# Altium project PicoRom-Flex.PrjPcb
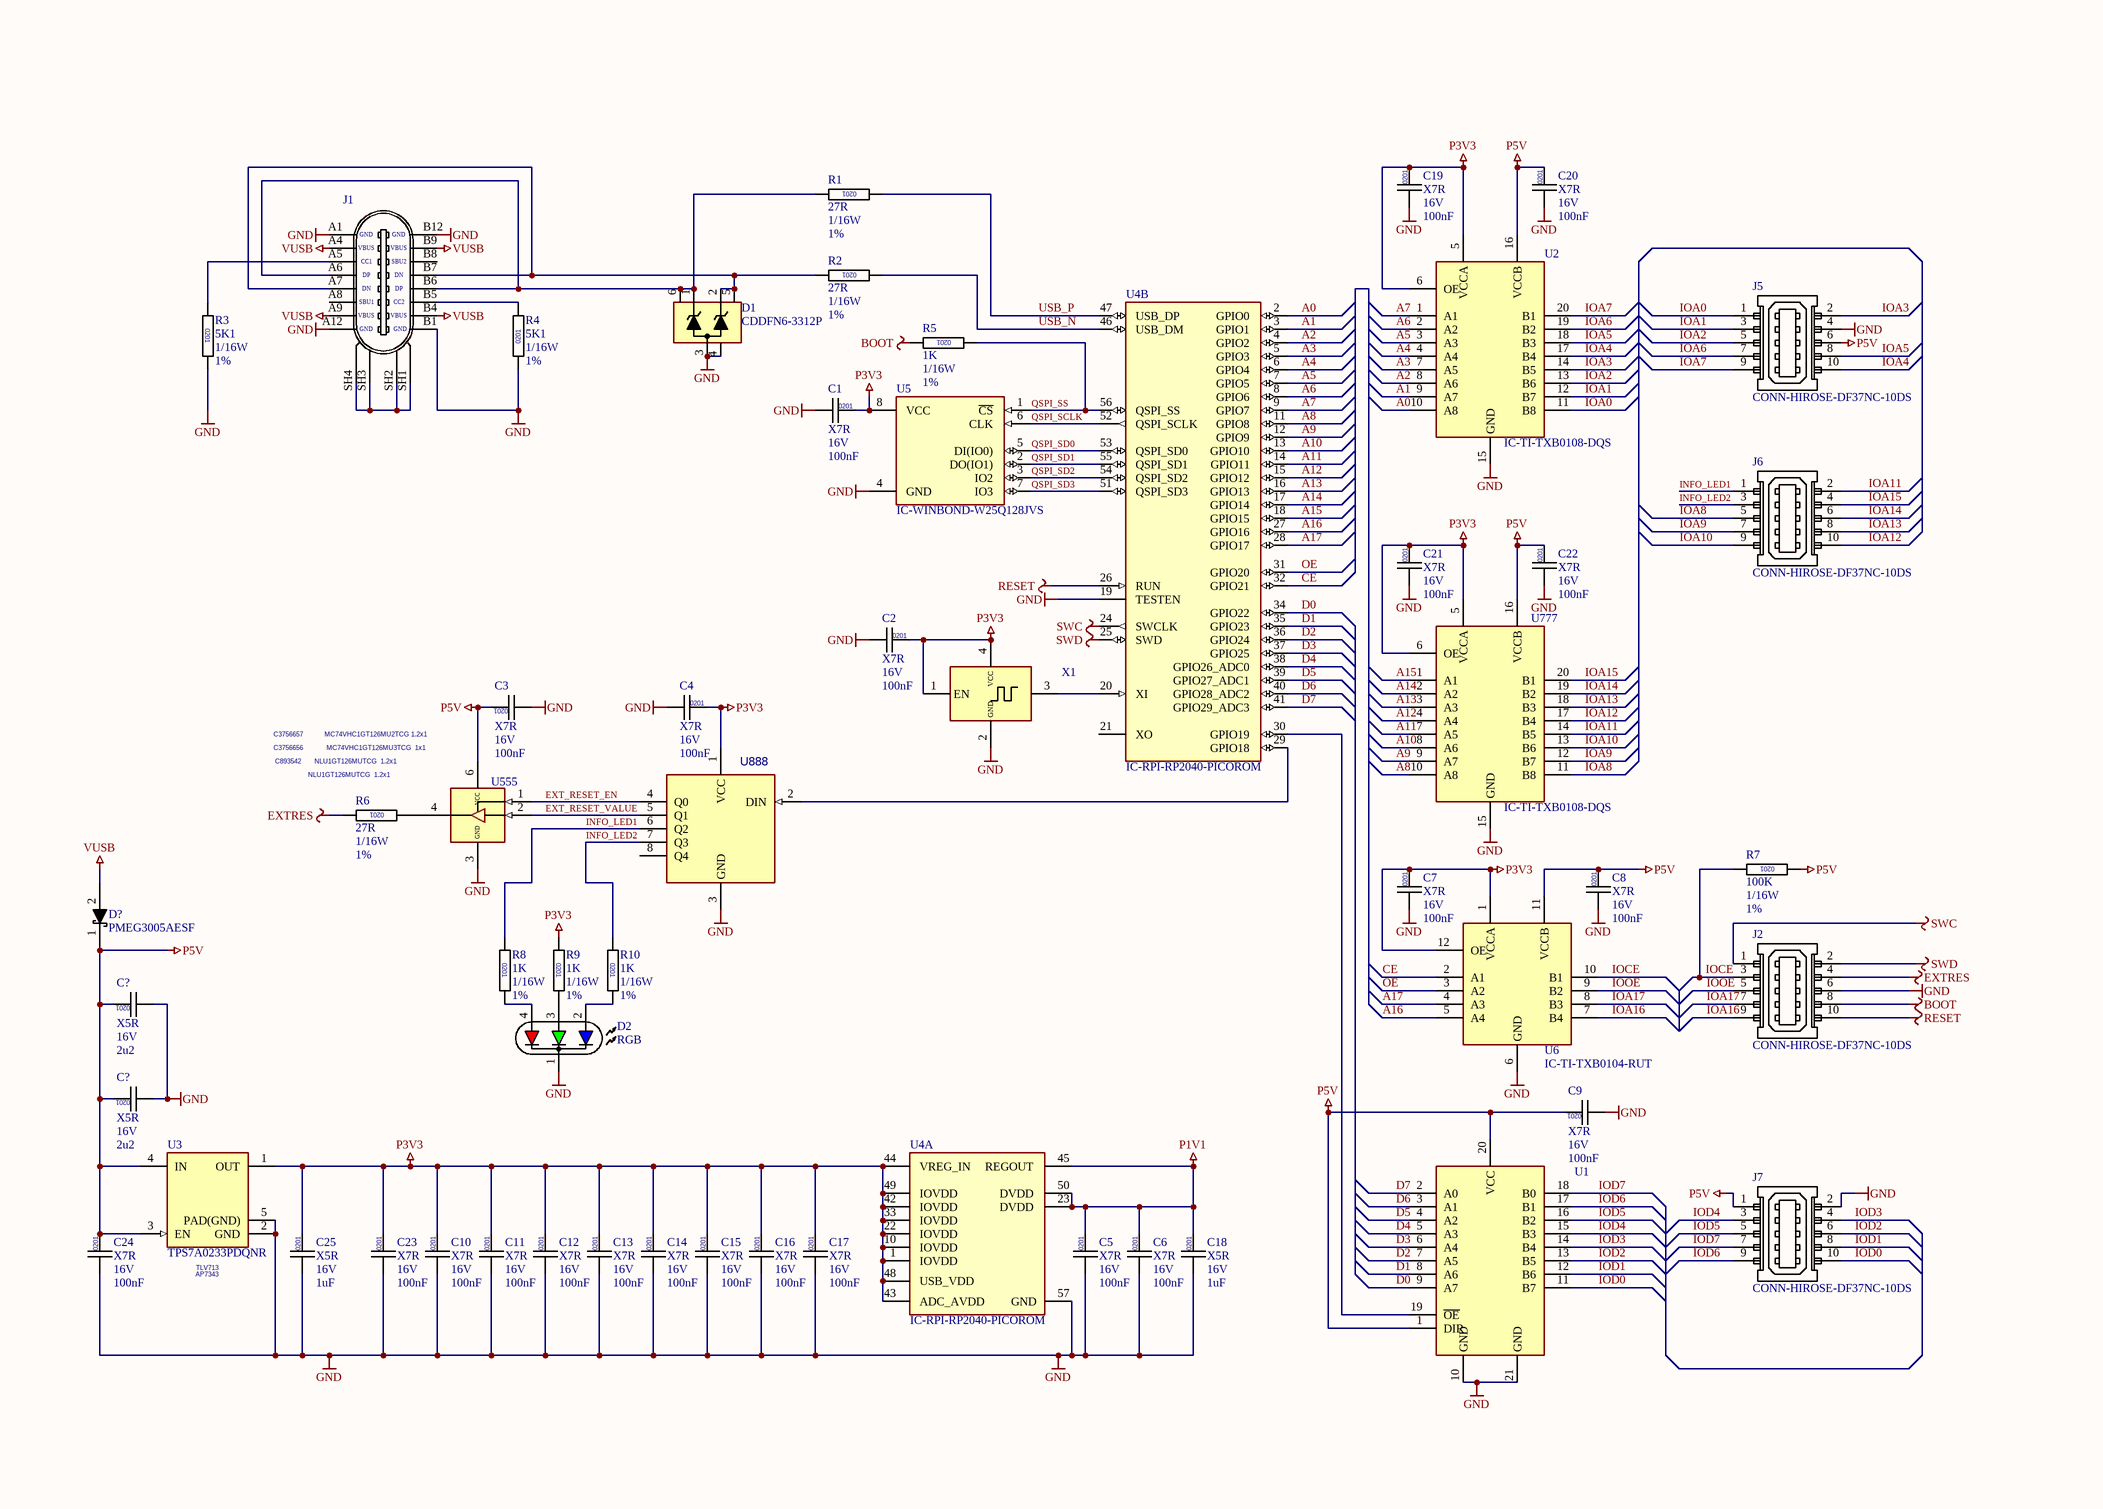
[diagram p0: PicoROM.SchDoc]
2 sheets, 59 parts. Net scope: hierarchical (ports join the sheet entries above them; power ports are global).
Board files: PICOROM-Flex.PcbDoc, pond.PcbDoc
Sheets:
  PicoROM.SchDoc
  2716-2736.SchDoc

## Sheet PicoROM.SchDoc
size A3; SheetNumber: 1; SheetTotal: 2

### Parts
(Parts that share a designator on the sheet are numbered #1, #2 ... from top to bottom, then left to right.)
C1  Dielectric: X7R  Voltage: 16V  Capacitance: 100nF  [CAPC0201]  (hidden comment: CAP0201)
C2  Dielectric: X7R  Voltage: 16V  Capacitance: 100nF  [CAPC0201]  (hidden comment: CAP0201)
C3  Dielectric: X7R  Voltage: 16V  Capacitance: 100nF  [CAPC0201]  (hidden comment: CAP0201)
C4  Dielectric: X7R  Voltage: 16V  Capacitance: 100nF  [CAPC0201]  (hidden comment: CAP0201)
C5  Dielectric: X7R  Voltage: 16V  Capacitance: 100nF  [CAPC0201]  (hidden comment: CAP0201)
C6  Dielectric: X7R  Voltage: 16V  Capacitance: 100nF  [CAPC0201]  (hidden comment: CAP0201)
C7  Dielectric: X7R  Voltage: 16V  Capacitance: 100nF  [CAPC0201]  (hidden comment: CAP0201)
C8  Dielectric: X7R  Voltage: 16V  Capacitance: 100nF  [CAPC0201]  (hidden comment: CAP0201)
C9  Dielectric: X7R  Voltage: 16V  Capacitance: 100nF  [CAPC0201]  (hidden comment: CAP0201)
C10  Dielectric: X7R  Voltage: 16V  Capacitance: 100nF  [CAPC0201]  (hidden comment: CAP0201)
C11  Dielectric: X7R  Voltage: 16V  Capacitance: 100nF  [CAPC0201]  (hidden comment: CAP0201)
C12  Dielectric: X7R  Voltage: 16V  Capacitance: 100nF  [CAPC0201]  (hidden comment: CAP0201)
C13  Dielectric: X7R  Voltage: 16V  Capacitance: 100nF  [CAPC0201]  (hidden comment: CAP0201)
C14  Dielectric: X7R  Voltage: 16V  Capacitance: 100nF  [CAPC0201]  (hidden comment: CAP0201)
C15  Dielectric: X7R  Voltage: 16V  Capacitance: 100nF  [CAPC0201]  (hidden comment: CAP0201)
C16  Dielectric: X7R  Voltage: 16V  Capacitance: 100nF  [CAPC0201]  (hidden comment: CAP0201)
C17  Dielectric: X7R  Voltage: 16V  Capacitance: 100nF  [CAPC0201]  (hidden comment: CAP0201)
C18  Dielectric: X5R  Voltage: 16V  Capacitance: 1uF  [CAPC0201]  (hidden comment: CAP0201)
C19  Dielectric: X7R  Voltage: 16V  Capacitance: 100nF  [CAPC0201]  (hidden comment: CAP0201)
C20  Dielectric: X7R  Voltage: 16V  Capacitance: 100nF  [CAPC0201]  (hidden comment: CAP0201)
C21  Dielectric: X7R  Voltage: 16V  Capacitance: 100nF  [CAPC0201]  (hidden comment: CAP0201)
C22  Dielectric: X7R  Voltage: 16V  Capacitance: 100nF  [CAPC0201]  (hidden comment: CAP0201)
C23  Dielectric: X7R  Voltage: 16V  Capacitance: 100nF  [CAPC0201]  (hidden comment: CAP0201)
C24  Dielectric: X7R  Voltage: 16V  Capacitance: 100nF  [CAPC0201]  (hidden comment: CAP0201)
C25  Dielectric: X5R  Voltage: 16V  Capacitance: 1uF  [CAPC0201]  (hidden comment: CAP0201)
C?#1  Dielectric: X5R  Voltage: 16V  Capacitance: 2u2  [CAPC0201]  (hidden comment: CAP0201)
C?#2  Dielectric: X5R  Voltage: 16V  Capacitance: 2u2  [CAPC0201]  (hidden comment: CAP0201)
D1  CDDFN6-3312P  [SON40P100X50-6L]
D2  RGB  [LED-1616-RGB]
D?  PMEG3005AESF
J1  CONN-SAMESKY-UJ20-C-V-G-SMT-P16-TR  [CONN-SAMESKY-UJ20-C-V-G-SMT-P16-TR]  (value not drawn)
J2  CONN-HIROSE-DF37NC-10DS  [CONN-HIROSE-DF37NC-10DS]
J5  CONN-HIROSE-DF37NC-10DS  [CONN-HIROSE-DF37NC-10DS]
J6  CONN-HIROSE-DF37NC-10DS  [CONN-HIROSE-DF37NC-10DS]
J7  CONN-HIROSE-DF37NC-10DS  [CONN-HIROSE-DF37NC-10DS]
R1  value 27R  Power: 1/16W  Tolerance: 1%  [RESC0201]  (hidden comment: RESC0201)
R2  value 27R  Power: 1/16W  Tolerance: 1%  [RESC0201]  (hidden comment: RESC0201)
R3  value 5K1  Power: 1/16W  Tolerance: 1%  [RESC0201]  (hidden comment: RESC0201)
R4  value 5K1  Power: 1/16W  Tolerance: 1%  [RESC0201]  (hidden comment: RESC0201)
R5  value 1K  Power: 1/16W  Tolerance: 1%  [RESC0201]  (hidden comment: RESC0201)
R6  value 27R  Power: 1/16W  Tolerance: 1%  [RESC0201]  (hidden comment: RESC0201)
R7  value 100K  Power: 1/16W  Tolerance: 1%  [RESC0201]  (hidden comment: RESC0201)
R8  value 1K  Power: 1/16W  Tolerance: 1%  [RESC0201]  (hidden comment: RESC0201)
R9  value 1K  Power: 1/16W  Tolerance: 1%  [RESC0201]  (hidden comment: RESC0201)
R10  value 1K  Power: 1/16W  Tolerance: 1%  [RESC0201]  (hidden comment: RESC0201)
U1  74AHCT245  [QFN50P450X250-20TH300X100]  (value not drawn)
U2  IC-TI-TXB0108-DQS  [SON40P200X55-20N]
U3  TPS7A0233PDQNR  [X2SON4-1X1]
U4  IC-RPI-RP2040-PICOROM  [QFN40P700X700X90-56N-TH310X310]  (parts A,B of 2)
U5  IC-WINBOND-W25Q128JVS  [SON50P300X60_HS-9N]
U6  IC-TI-TXB0104-RUT  [FOOTPRINT-TI-RUT]
U555  74LVC1G126  [SON40P100X50-6L]  (value not drawn)
U777  IC-TI-TXB0108-DQS  [SON40P200X55-20N]
U888  TCA5405RUGR  [X2QFN-8_L1.5-W1.5-P0.50-BL]  (value not drawn)
X1  XOSC  [XOSC-YXC-2016]  (value not drawn)

### Nets
BOOT: J2.8 R5.1
EXTRES: J2.4 R6.1
GND: C1.2 C2.2 C3.2 C4.2 C5.2 C6.2 C7.2 C8.2 C9.2 C10.2 C11.2 C12.2 C13.2 C14.2 C15.2 C16.2 C17.2 C18.2 C19.2 C20.2 C21.2 C22.2 C23.2 C24.2 C25.2 C?#1.2 C?#2.2 D1.3(A) D1.4(A) D2.1 J1.A1 J1.A12 J1.B1 J1.B12 J2.6 J5.4 J7.2 R3.1 R4.2 U1.10(GND) U1.21(GND) U2.15(GND) U3.2(GND) U3.5(PAD(GND)) U4.19(TESTEN) U4.57(GND) U5.4(GND) U6.6(GND) U555.3(GND) U777.15(GND) U888.3(GND) X1.2(GND)
P1V1: C5.1 C6.1 C18.1 U4.23(DVDD) U4.45(REGOUT) U4.50(DVDD)
P3V3: C1.1 C2.1 C4.1 C7.1 C10.1 C11.1 C12.1 C13.1 C14.1 C15.1 C16.1 C17.1 C19.1 C21.1 C23.1 C25.1 R9.2 U2.5(VCCA) U2.6(OE) U3.1(OUT) U4.1(IOVDD) U4.10(IOVDD) U4.22(IOVDD) U4.33(IOVDD) U4.42(IOVDD) U4.43(ADC_AVDD) U4.44(VREG_IN) U4.48(USB_VDD) U4.49(IOVDD) U5.8(VCC) U6.1(VCCA) U6.12(OE) U777.5(VCCA) U777.6(OE) U888.1(VCC) X1.1(EN) X1.4(VCC)
P5V: C3.1 C8.1 C9.1 C20.1 C22.1 C24.1 C?#1.1 C?#2.1 D?.1(K) J5.6 J7.1 R7.2 U1.1(DIR) U1.20(VCC) U2.16(VCCB) U3.3(EN) U3.4(IN) U6.11(VCCB) U555.6(VCC) U777.16(VCCB)
RESET: J2.10 U4.26(RUN)
SWC: J2.1 U4.24(SWCLK)
SWD: J2.2 U4.25(SWD)
VUSB: D?.2(A) J1.A4 J1.A9 J1.B4 J1.B9
A0: U2.10(A8) U4.2(GPIO0)
A1: U2.9(A7) U4.3(GPIO1)
A2: U2.8(A6) U4.4(GPIO2)
A3: U2.7(A5) U4.5(GPIO3)
A4: U2.4(A4) U4.6(GPIO4)
A5: U2.3(A3) U4.7(GPIO5)
A6: U2.2(A2) U4.8(GPIO6)
A7: U2.1(A1) U4.9(GPIO7)
A8: U4.11(GPIO8) U777.10(A8)
A9: U4.12(GPIO9) U777.9(A7)
A10: U4.13(GPIO10) U777.8(A6)
A11: U4.14(GPIO11) U777.7(A5)
A12: U4.15(GPIO12) U777.4(A4)
A13: U4.16(GPIO13) U777.3(A3)
A14: U4.17(GPIO14) U777.2(A2)
A15: U4.18(GPIO15) U777.1(A1)
A16: U4.27(GPIO16) U6.5(A4)
A17: U4.28(GPIO17) U6.4(A3)
CE: U4.32(GPIO21) U6.2(A1)
D0: U1.9(A7) U4.34(GPIO22)
D1: U1.8(A6) U4.35(GPIO23)
D2: U1.7(A5) U4.36(GPIO24)
D3: U1.6(A4) U4.37(GPIO25)
D4: U1.5(A3) U4.38(GPIO26_ADC0)
D5: U1.4(A2) U4.39(GPIO27_ADC1)
D6: U1.3(A1) U4.40(GPIO28_ADC2)
D7: U1.2(A0) U4.41(GPIO29_ADC3)
EXT_RESET_EN: U555.1 U888.4(Q0)
EXT_RESET_VALUE: U555.2 U888.5(Q1)
INFO_LED1: J6.1 R8.2 U888.6(Q2)
INFO_LED2: J6.3 R10.2 U888.7(Q3)
IOA0: J5.1 U2.11(B8)
IOA1: J5.3 U2.12(B7)
IOA2: J5.5 U2.13(B6)
IOA3: J5.2 U2.14(B5)
IOA4: J5.10 U2.17(B4)
IOA5: J5.8 U2.18(B3)
IOA6: J5.7 U2.19(B2)
IOA7: J5.9 U2.20(B1)
IOA8: J6.5 U777.11(B8)
IOA9: J6.7 U777.12(B7)
IOA10: J6.9 U777.13(B6)
IOA11: J6.2 U777.14(B5)
IOA12: J6.10 U777.17(B4)
IOA13: J6.8 U777.18(B3)
IOA14: J6.6 U777.19(B2)
IOA15: J6.4 U777.20(B1)
IOA16: J2.9 U6.7(B4)
IOA17: J2.7 U6.8(B3)
IOCE: J2.3 R7.1 U6.10(B1)
IOD0: J7.10 U1.11(B7)
IOD1: J7.8 U1.12(B6)
IOD2: J7.6 U1.13(B5)
IOD3: J7.4 U1.14(B4)
IOD4: J7.3 U1.15(B3)
IOD5: J7.5 U1.16(B2)
IOD6: J7.9 U1.17(B1)
IOD7: J7.7 U1.18(B0)
IOOE: J2.5 U6.9(B2)
OE: U4.31(GPIO20) U6.3(A2)
QSPI_SCLK: U4.52(QSPI_SCLK) U5.6(CLK)
QSPI_SD0: U4.53(QSPI_SD0) U5.5(DI(IO0))
QSPI_SD1: U4.55(QSPI_SD1) U5.2(DO(IO1))
QSPI_SD2: U4.54(QSPI_SD2) U5.3(IO2)
QSPI_SD3: U4.51(QSPI_SD3) U5.7(IO3)
QSPI_SS: R5.2 U4.56(QSPI_SS) U5.1(~{CS})
USB_N: R2.2 U4.46(USB_DM)
USB_P: R1.2 U4.47(USB_DP)
NetD1_1: D1.1(K) D1.6(A) J1.A6 J1.B6 R1.1
NetD1_2: D1.2(A) D1.5(A) J1.A7 J1.B7 R2.1
NetD2_2: D2.2 R10.1
NetD2_3: D2.3 R9.1
NetD2_4: D2.4 R8.1
NetJ1_A5: J1.A5 R3.2
NetJ1_B5: J1.B5 R4.1
NetJ1_SH1: J1.SH1(SHIELD) J1.SH2(SHIELD) J1.SH3(SHIELD) J1.SH4(SHIELD)
NetR6_2: R6.2 U555.4
NetU1_19: U1.19(~{OE}) U4.30(GPIO19)
NetU4_20: U4.20(XI) X1.3(OSC2)
NetU4_29: U4.29(GPIO18) U888.2(DIN)

Not connected (* = marked no-connect by the designer): J1 A8 B8; U4 21(XO); U888 8(Q4)

### Notes on the sheet
- C3756656
- C3756657
- C893542
- (near R6) NLU1GT126MUTCG  1.2x1
- NLU1GT126MUTCG  1.2x1
- MC74VHC1GT126MU3TCG  1x1
- MC74VHC1GT126MU2TCG 1.2x1
- (near U3) TLV713
- (near U3) AP7343
- THIS DOCUMENT AND THE DATA DISCLOSED HEREIN OR
- HEREWITH IS THE PROPERTY OF ALTIUM LIMITED AND MAY
- DWG NO:
- REVISION
- REV:
- DESCRIPTION
- DATE
- APPROVED
- BE FREELY DISTRIBUTED IN WHOLE. NO RIGHTS ARE
- RESERVED OR EXPRESS OR IMPLIED WARANTEE GIVEN.
- ENG:
- APPROVALS
- PROJECT
- DSN:
- CHK:
- REFERENCE DOCUMENTS
- PROJECT REVISION:
- TITLE
- DOCUMENT REVISION:
- DESIGN ITEM:
- BOM:
- FAB DWG:
- PCB DWG:
- ASSY DWG:
- SCALE:
- A3
- SIZE
- CAGE CODE
- FILE NAME
- DWG NO.
- SHEET
- OF
- REV
- (in symbol CAPC-0201-1uF-16V-X5R) 0201
- (in symbol CAPC-0201-2u2-16V-X5R) 0201
- (in symbol CAPC-0201-100nF-16V) 0201
- (in symbol CONN-SAMESKY-UJ20-C-V-G-SMT-P16-TR) GND; VBUS; CC1; SBU2; DP; DN; SBU1; CC2
- (in symbol RESC-0201-1K-1%-1/10W) 0201
- (in symbol RESC-0201-5K1-1%-1/10W) 0201
- (in symbol RESC-0201-27R-1%-1/10W) 0201
- (in symbol RESC-0201-100K-1%-1/10W) 0201

### Library data of the parts
C1-C17 C19-C24 = CAPC-0201-100nF-16V: CAPACITOR,CERAMIC,100nF,16V,X7R,0201; Package / Case: 0402; Location: *; LCSC: C668346; Supplier 1: Digikey; Supplier Part Number 1: 490-GRM033Z71C104KE14DCT-ND
C18 C25 = CAPC-0201-1uF-16V-X5R: CAPACITOR,CERAMIC,1uF,16V,X5R,0201; Package / Case: 0402; Location: *; LCSC: C307385; Supplier 1: Digikey; Supplier Part Number 1: 1276-6798-1-ND
C?#1 C?#2 = CAPC-0201-2u2-16V-X5R: CAPACITOR,CERAMIC,2u2,16V,X5R,0201; Package / Case: 0402; Location: *; LCSC: C6204143; Supplier 1: Mouser; Supplier Part Number 1: 81-GRM035R61C225ME1D
D1 = TVS-BOURNS-CDDFN6-3312P: LCSC: C3700524
D2 = LED-TOGIALED-TJ-S1615CY6TGLCCSRGB-A5: MFR: KINGBRIGHT; MPN: APTF1616SEKJ3ZGKQBKC; LCSC: C601684
D? = DIODE-NEXPERIA-PMEG3005AESF: LCSC: C552848
R1 R2 R6 = RESC-0201-27R-1%-1/10W: RESISTOR,27R,1%,63mW,0201; Location: *; LCSC: C473051
R3 R4 = RESC-0201-5K1-1%-1/10W: RESISTOR,5K1,1%,63mW,0201; Location: *; LCSC: C274341
R5 R8-R10 = RESC-0201-1K-1%-1/10W: RESISTOR,1K,1%,63mW,0201; Location: *; LCSC: C138165
R7 = RESC-0201-100K-1%-1/10W: RESISTOR,100K,1%,63mW,0201; Location: *; LCSC: C106224
U1 = IC-NEXPERIA-74AHCT245
U3 = IC-TI-TPS7A0233PDQNR: LCSC: C2860046
U555 = IC-DIODES-74LVC1G126-SON6: MPN: C163712
U888 = IC-TI-TCA5405RUGR: MPN: C2674123; Footprint: RP2040_minimal:X2QFN-8_L1.5-W1.5-P0.50-BL
X1 = XOSC-YXC-OT201612MJBA4SL: XTAL,4PIN; LCSC: C669076
J1 = CONN-SAMESKY-UJ20-C-V-G-SMT-P16-TR: Package: None; Price: None; Value: *; MP: UJ20-C-V-G-SMT-P16-TR; Availability: Unavailable; LCSC: C2686963; MPN: UJ20-C-V-G-SMT-P16-TR; MFR: SAMESKY
J2 J5-J7 = CONN-HIROSE-DF37NC-10DS: LCSC: C324718
U4 = IC-RPI-RP2040-PICOROM: LCSC: C2040

## Sheet 2716-2736.SchDoc
size A; SheetNumber: 1; SheetTotal: 2
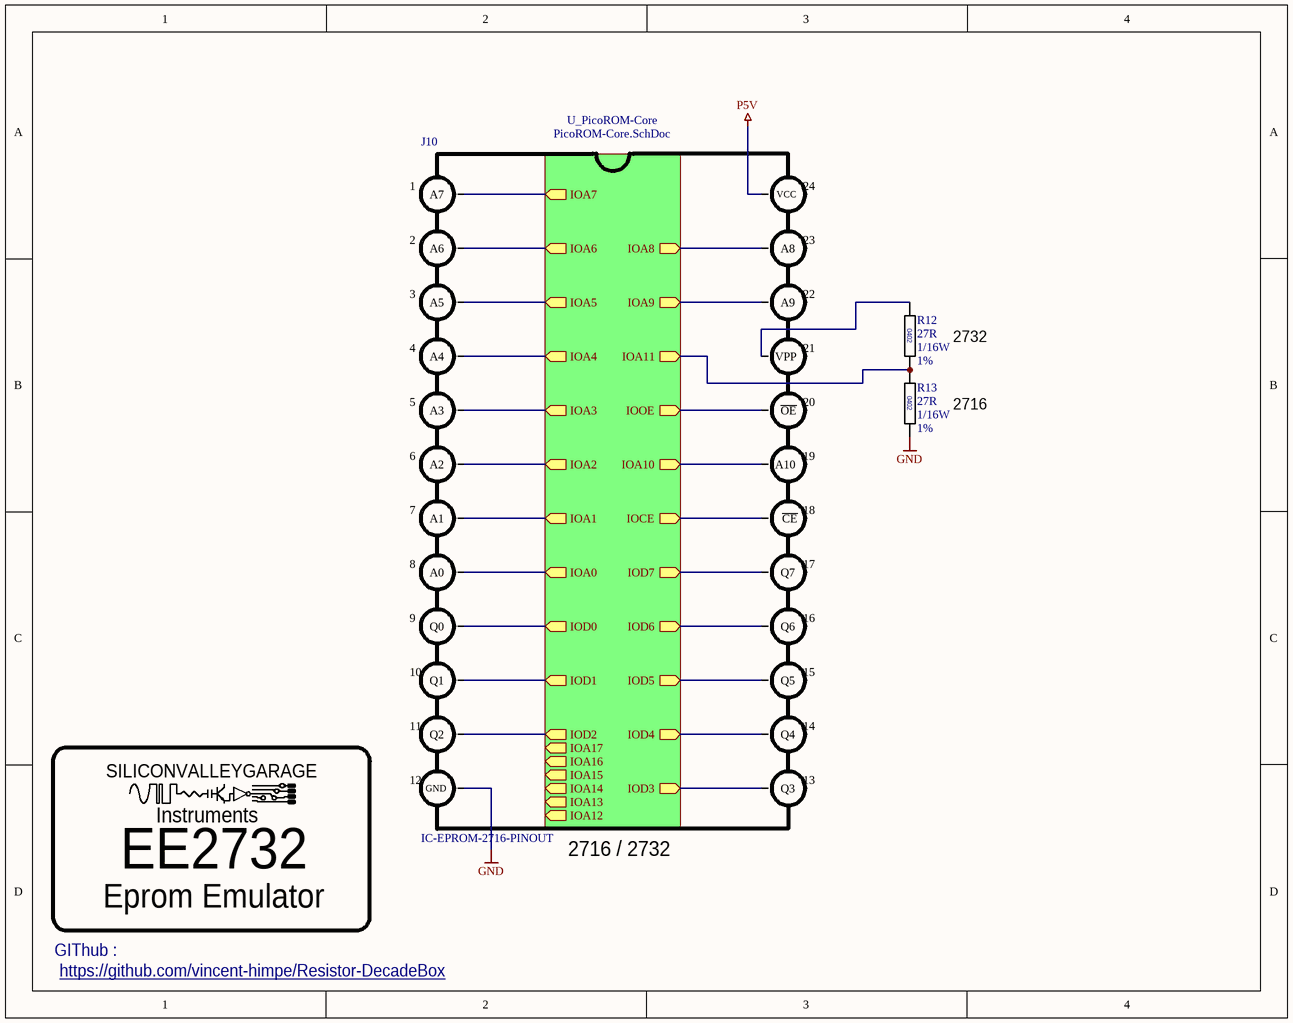
[diagram p1: 2716-2736.SchDoc]

### Parts
J10  IC-EPROM-2716-PINOUT  [DIL24-PLUG]
LOGO?  LOGO-SILICONVALLEYGARAGE-SMALL  [SILICONVALLEYGARAGE]  (value not drawn)  (graphical)
R12  value 27R  Power: 1/16W  Tolerance: 1%  [RESC0402]  (hidden comment: RESC0402)
R13  value 27R  Power: 1/16W  Tolerance: 1%  [RESC0402]  (hidden comment: RESC0402)

### Blocks framed on the sheet
EE2732: LOGO?

### Sub-sheets
U_PicoROM-Core = PicoROM-Core.SchDoc (file not in this document): IOA0 (out), IOA1 (out), IOA2 (out), IOA3 (out), IOA4 (out), IOA5 (out), IOA6 (out), IOA7 (out), IOA8 (out), IOA9 (out), IOA10 (out), IOA11 (out), IOA12 (out), IOA13 (out), IOA14 (out), IOA15 (out), IOD0 (out), IOD1 (out), IOD2 (out), IOD3 (out), IOD4 (out), IOD5 (out), IOD6 (out), IOD7 (out), IOCE (out), IOOE (out), IOA16 (out), IOA17 (out)

### Nets
GND: J10.12(GND) R13.1
P5V: J10.24(VCC)
NetJ10_1: J10.1(A7) ; sheet U_PicoROM-Core/IOA7
NetJ10_2: J10.2(A6) ; sheet U_PicoROM-Core/IOA6
NetJ10_3: J10.3(A5) ; sheet U_PicoROM-Core/IOA5
NetJ10_4: J10.4(A4) ; sheet U_PicoROM-Core/IOA4
NetJ10_5: J10.5(A3) ; sheet U_PicoROM-Core/IOA3
NetJ10_6: J10.6(A2) ; sheet U_PicoROM-Core/IOA2
NetJ10_7: J10.7(A1) ; sheet U_PicoROM-Core/IOA1
NetJ10_8: J10.8(A0) ; sheet U_PicoROM-Core/IOA0
NetJ10_9: J10.9(Q0) ; sheet U_PicoROM-Core/IOD0
NetJ10_10: J10.10(Q1) ; sheet U_PicoROM-Core/IOD1
NetJ10_11: J10.11(Q2) ; sheet U_PicoROM-Core/IOD2
NetJ10_13: J10.13(Q3) ; sheet U_PicoROM-Core/IOD3
NetJ10_14: J10.14(Q4) ; sheet U_PicoROM-Core/IOD4
NetJ10_15: J10.15(Q5) ; sheet U_PicoROM-Core/IOD5
NetJ10_16: J10.16(Q6) ; sheet U_PicoROM-Core/IOD6
NetJ10_17: J10.17(Q7) ; sheet U_PicoROM-Core/IOD7
NetJ10_18: J10.18(~{CE}) ; sheet U_PicoROM-Core/IOCE
NetJ10_19: J10.19(A10) ; sheet U_PicoROM-Core/IOA10
NetJ10_20: J10.20(~{OE}) ; sheet U_PicoROM-Core/IOOE
NetJ10_21: J10.21(VPP) R12.2
NetJ10_22: J10.22(A9) ; sheet U_PicoROM-Core/IOA9
NetJ10_23: J10.23(A8) ; sheet U_PicoROM-Core/IOA8
NetR12_1: R12.1 R13.2 ; sheet U_PicoROM-Core/IOA11

### Notes on the sheet
- 2732
- 2716
- (near LOGO?) Instruments
- Eprom Emulator
- (near J10) 2716 / 2732
- https://github.com/vincent-himpe/Resistor-DecadeBox
- GIThub :
- (in symbol LOGO-SILICONVALLEYGARAGE-SMALL) SILICONVALLEYGARAGE
- (in symbol RESC-0402-27R-1%-1/10W) 0402

### Library data of the parts
J10 = IC-EPROM-2716-PINOUT: CONN,DIP24,MALE PINHEADER,TURNED PIN,GOLD; Manufacturer 1: CNCTECH; Manufacturer Part Number 1: 220-1-24-006; DIGIKEY: 1175-1524-5-ND
LOGO? = LOGO-SILICONVALLEYGARAGE-SMALL: LOGO,SILICONVALLEYGARAGE,SMALL
R12 R13 = RESC-0402-27R-1%-1/10W: RESISTOR,27R,1%,63mW,0402 (1005); Location: *; LCSC: C138021; Supplier 1: Future Electronics; Supplier Part Number 1: 2577120

## Nets that join several sheets
GND: PicoROM (52 pins), 2716-2736 (J10.12 R13.1)
P5V: PicoROM (20 pins), 2716-2736 (J10.24)